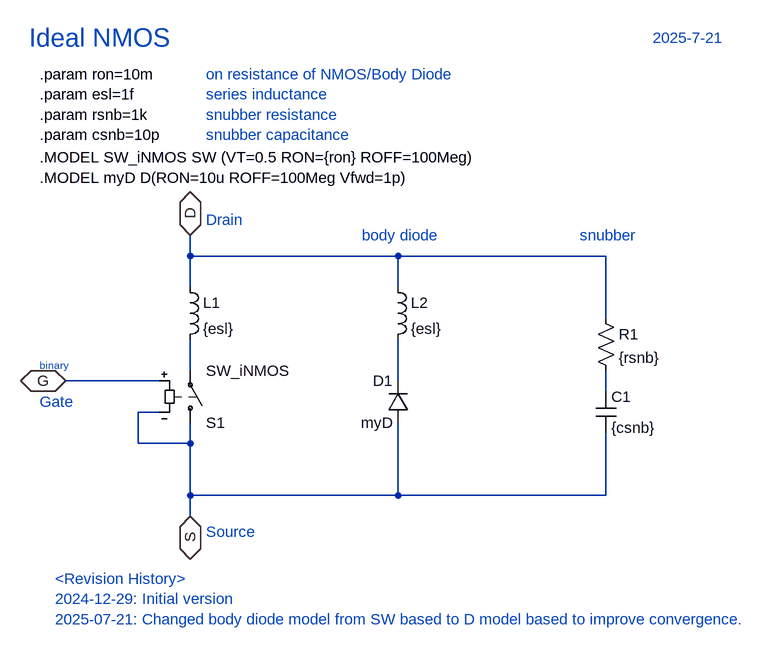
[diagram p0: schematic iNMOS.asc]
iNMOS.asc, the LTspice schematic file:
Version 4.1
SHEET 1 1384 680
WIRE 288 -288 288 -320
WIRE 608 -288 288 -288
WIRE 928 -288 608 -288
WIRE 288 -240 288 -288
WIRE 608 -240 608 -288
WIRE 928 -192 928 -288
WIRE 288 -112 288 -160
WIRE 240 -96 96 -96
WIRE 608 -96 608 -160
WIRE 928 -80 928 -112
WIRE 240 -48 208 -48
WIRE 208 0 208 -48
WIRE 288 0 288 -32
WIRE 288 0 208 0
WIRE 288 80 288 0
WIRE 608 80 608 -32
WIRE 608 80 288 80
WIRE 928 80 928 -16
WIRE 928 80 608 80
WIRE 288 112 288 80
FLAG 288 -320 D
IOPIN 288 -320 BiDir
FLAG 288 112 S
IOPIN 288 112 BiDir
FLAG 96 -96 G
IOPIN 96 -96 BiDir
SYMBOL sw 288 -16 M180
SYMATTR InstName S1
SYMATTR Value SW_iNMOS
SYMBOL res 912 -208 R0
SYMATTR InstName R1
SYMATTR Value {rsnb}
SYMBOL cap 912 -80 R0
SYMATTR InstName C1
SYMATTR Value {csnb}
SYMBOL ind 272 -256 R0
SYMATTR InstName L1
SYMATTR Value {esl}
SYMBOL diode 624 -32 R180
WINDOW 0 24 64 Left 2
WINDOW 3 24 0 Left 2
SYMATTR InstName D1
SYMATTR Value myD
SYMBOL ind 592 -256 R0
SYMATTR InstName L2
SYMATTR Value {esl}
TEXT 56 -440 Left 2 !.MODEL SW_iNMOS SW (VT=0.5 RON={ron} ROFF=100Meg)\n.MODEL myD D(RON=10u ROFF=100Meg Vfwd=1p)
TEXT 56 -568 Left 2 !.param ron=10m\n.param esl=1f\n.param rsnb=1k\n.param csnb=10p
TEXT 552 -320 Left 2 ;body diode
TEXT 888 -320 Left 2 ;snubber
TEXT 56 -120 Left 1 ;binary
TEXT 40 -624 Left 4 ;Ideal NMOS
TEXT 312 -568 Left 2 ;on resistance of NMOS/Body Diode\nseries inductance\nsnubber resistance\nsnubber capacitance
TEXT 312 -344 Left 2 ;Drain
TEXT 312 136 Left 2 ;Source
TEXT 56 -64 Left 2 ;Gate
TEXT 1000 -624 Left 2 ;2025-7-21
TEXT 80 208 Left 2 ;<Revision History>\n2024-12-29: Initial version\n2025-07-21: Changed body diode model from SW based to D model based to improve convergence.

The netlist it stands for:
* iNMOS.asc
S1 S N001 G S SW_iNMOS
R1 D N003 {rsnb}
C1 N003 S {csnb}
L1 D N001 {esl}
D1 S N002 myD
L2 D N002 {esl}
.model D D
.lib standard.dio
.MODEL SW_iNMOS SW (VT=0.5 RON={ron} ROFF=100Meg)
.MODEL myD D(RON=10u ROFF=100Meg Vfwd=1p)
.param ron=10m
.param esl=1f
.param rsnb=1k
.param csnb=10p
* body diode
* snubber
* binary
* Ideal NMOS
* on resistance of NMOS/Body Diode
* series inductance
* snubber resistance
* snubber capacitance
* Drain
* Source
* Gate
* 2025-7-21
* <Revision History>
* 2024-12-29: Initial version
* 2025-07-21: Changed body diode model from SW based to D model based to improve convergence.
.backanno
.end